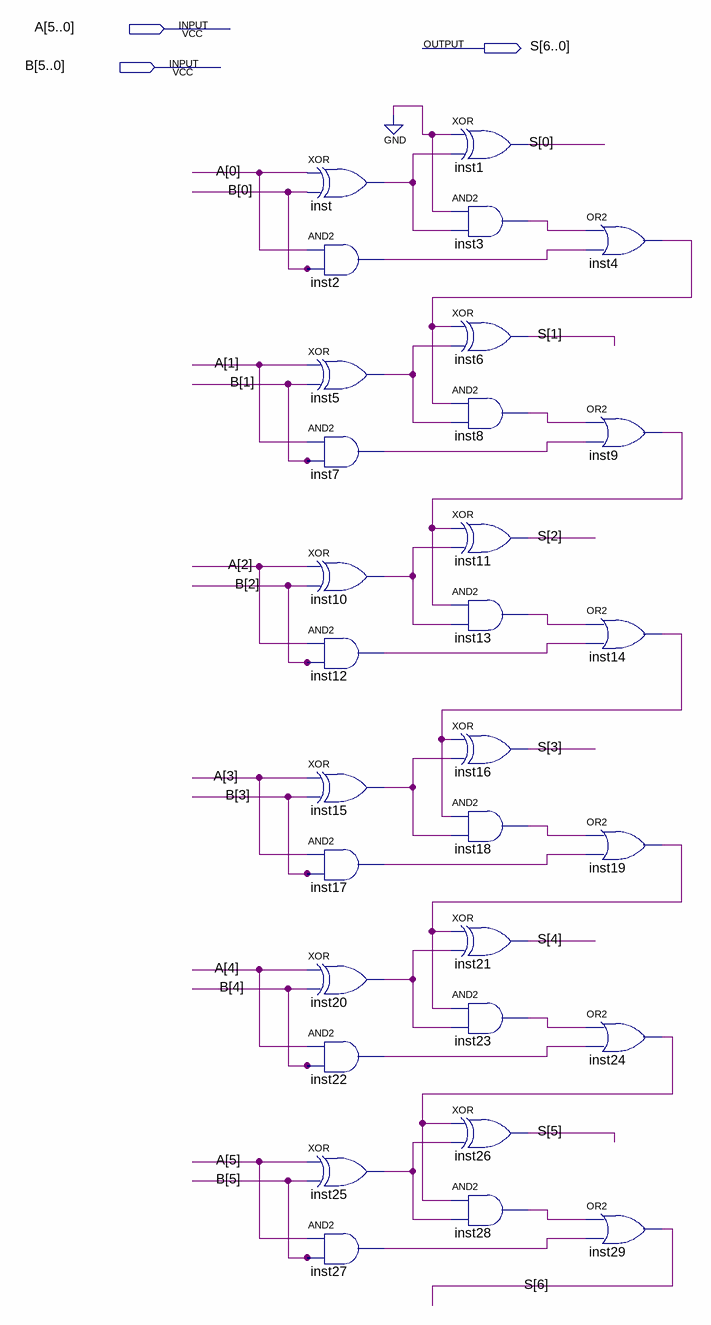
[diagram p0: schematic sheet]
// Quartus schematic g07_adder.bdf as structural Verilog: 30 symbols, 3 pins
module g07_adder (
  input  [5:0] A,
  input  [5:0] B,
  output [6:0] S
);

  wire inst2_out, inst3_out, inst4_out, inst5_out, inst7_out, inst8_out, inst9_out, inst10_out, inst12_out,
       inst13_out, inst14_out, inst15_out, inst17_out, inst18_out, inst19_out, inst20_out, inst22_out,
       inst23_out, inst24_out, inst25_out, inst27_out, inst28_out, inst_out;

  xor inst (inst_out, A[0], B[0]);
  and inst2 (inst2_out, A[0], B[0]);
  xor inst5 (inst5_out, A[1], B[1]);
  and inst7 (inst7_out, A[1], B[1]);
  xor inst10 (inst10_out, A[2], B[2]);
  and inst12 (inst12_out, A[2], B[2]);
  xor inst15 (inst15_out, A[3], B[3]);
  and inst17 (inst17_out, A[3], B[3]);
  xor inst20 (inst20_out, A[4], B[4]);
  and inst22 (inst22_out, A[4], B[4]);
  xor inst25 (inst25_out, A[5], B[5]);
  and inst27 (inst27_out, A[5], B[5]);
  xor inst1 (S[0], 1'b0, inst_out);
  and inst3 (inst3_out, 1'b0, inst_out);
  xor inst6 (S[1], inst4_out, inst5_out);
  and inst8 (inst8_out, inst4_out, inst5_out);
  xor inst11 (S[2], inst9_out, inst10_out);
  and inst13 (inst13_out, inst9_out, inst10_out);
  xor inst16 (S[3], inst14_out, inst15_out);
  and inst18 (inst18_out, inst14_out, inst15_out);
  xor inst21 (S[4], inst19_out, inst20_out);
  and inst23 (inst23_out, inst19_out, inst20_out);
  xor inst26 (S[5], inst24_out, inst25_out);
  and inst28 (inst28_out, inst24_out, inst25_out);
  or inst4 (inst4_out, inst3_out, inst2_out);
  or inst9 (inst9_out, inst8_out, inst7_out);
  or inst14 (inst14_out, inst13_out, inst12_out);
  or inst19 (inst19_out, inst18_out, inst17_out);
  or inst24 (inst24_out, inst23_out, inst22_out);
  or inst29 (S[6], inst28_out, inst27_out);
endmodule
